# EAGLE design 1U_attenuvert_redesign (EAGLE 9.5.1)
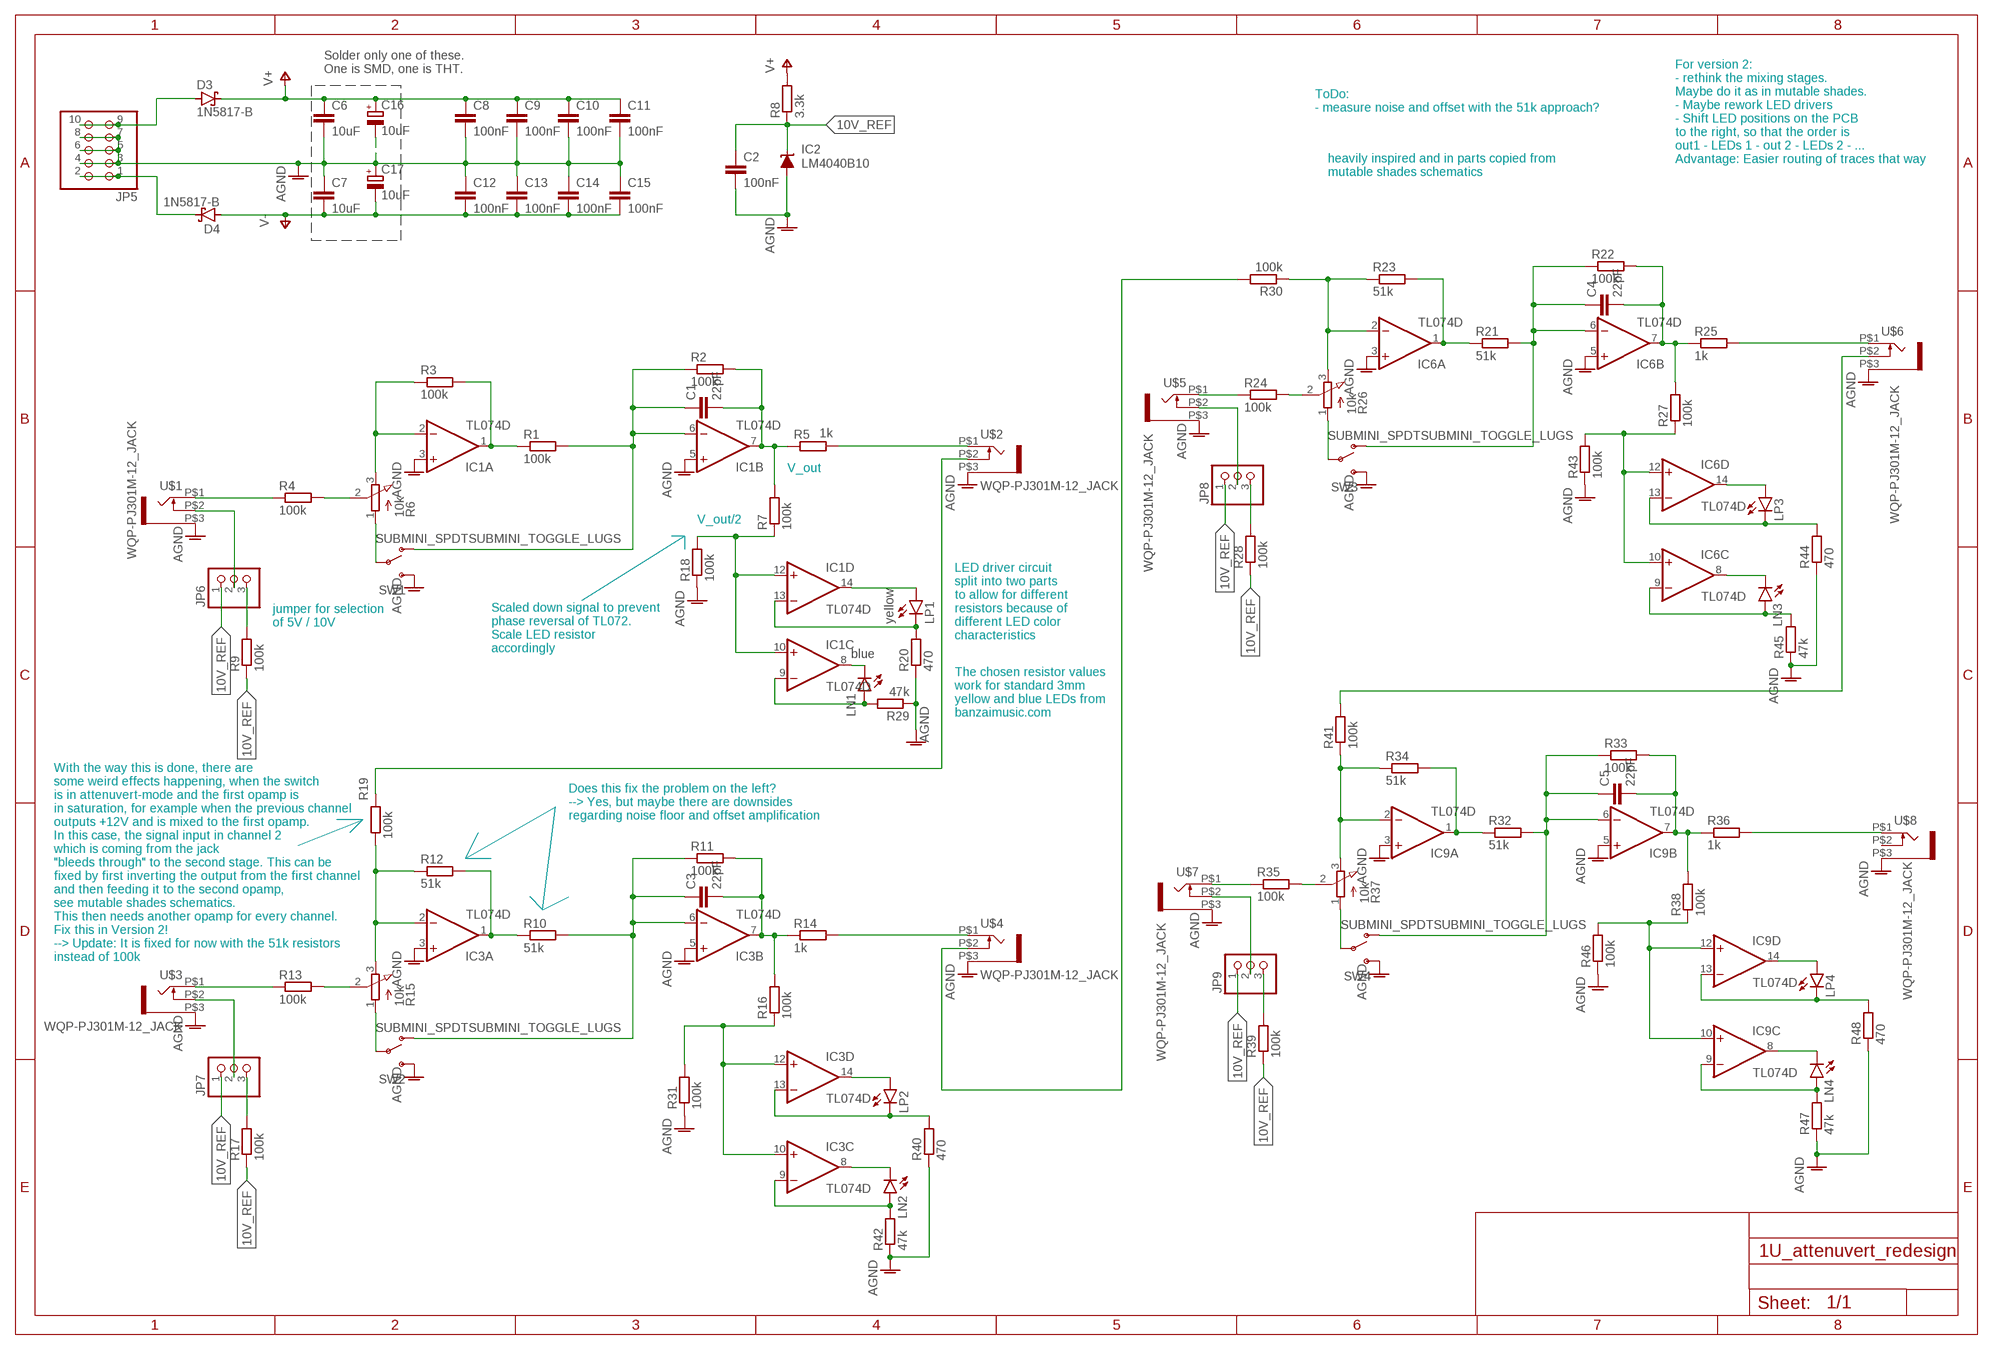
[diagram p0: schematic, sheet 1]

## Parts
C1  22pF  C-EUC0603  [C0603]
C2  100nF  C-EUC0603  [C0603]
C3  22pF  C-EUC0603  [C0603]
C4  22pF  C-EUC0603  [C0603]
C5  22pF  C-EUC0603  [C0603]
C6  10uF  C-EUC0805  [C0805]
C7  10uF  C-EUC0805  [C0805]
C8  100nF  C-EUC0603  [C0603]
C9  100nF  C-EUC0603  [C0603]
C10  100nF  C-EUC0603  [C0603]
C11  100nF  C-EUC0603  [C0603]
C12  100nF  C-EUC0603  [C0603]
C13  100nF  C-EUC0603  [C0603]
C14  100nF  C-EUC0603  [C0603]
C15  100nF  C-EUC0603  [C0603]
C16  10uF  CPOL-EUE2.5-6  [E2,5-6]
C17  10uF  CPOL-EUE2.5-6  [E2,5-6]
D3  1N5817-B  [DO41-7.6]
D4  1N5817-B  [DO41-7.6]
IC1  TL074D  [SO14]
IC2  LM4040B10  LM4041A12DBZ  [DBZ_R-PDSO-G3]
IC3  TL074D  [SO14]
IC6  TL074D  [SO14]
IC9  TL074D  [SO14]
JP5  PINHD-2X5  [2X05]
JP6  PINHD-1X3  [1X03]
JP7  PINHD-1X3  [1X03]
JP8  PINHD-1X3  [1X03]
JP9  PINHD-1X3  [1X03]
LN1  blue  LED3MM  [LED3MM]
LN2  LED3MM  [LED3MM]
LN3  LED3MM  [LED3MM]
LN4  LED3MM  [LED3MM]
LP1  yellow  LED3MM  [LED3MM]
LP2  LED3MM  [LED3MM]
LP3  LED3MM  [LED3MM]
LP4  LED3MM  [LED3MM]
R1  100k  R-EU_R0603  [R0603]
R2  100k  R-EU_R0603  [R0603]
R3  100k  R-EU_R0603  [R0603]
R4  100k  R-EU_R0603  [R0603]
R5  1k  R-EU_R0603  [R0603]
R6  10k  EVUF2L  [EVUFXL]
R7  100k  R-EU_R0603  [R0603]
R8  3.3k  R-EU_R0603  [R0603]
R9  100k  R-EU_R0603  [R0603]
R10  51k  R-EU_R0603  [R0603]
R11  100k  R-EU_R0603  [R0603]
R12  51k  R-EU_R0603  [R0603]
R13  100k  R-EU_R0603  [R0603]
R14  1k  R-EU_R0603  [R0603]
R15  10k  EVUF2L  [EVUFXL]
R16  100k  R-EU_R0603  [R0603]
R17  100k  R-EU_R0603  [R0603]
R18  100k  R-EU_R0603  [R0603]
R19  100k  R-EU_R0603  [R0603]
R20  470  R-EU_R0603  [R0603]
R21  51k  R-EU_R0603  [R0603]
R22  100k  R-EU_R0603  [R0603]
R23  51k  R-EU_R0603  [R0603]
R24  100k  R-EU_R0603  [R0603]
R25  1k  R-EU_R0603  [R0603]
R26  10k  EVUF2L  [EVUFXL]
R27  100k  R-EU_R0603  [R0603]
R28  100k  R-EU_R0603  [R0603]
R29  47k  R-EU_R0603  [R0603]
R30  100k  R-EU_R0603  [R0603]
R31  100k  R-EU_R0603  [R0603]
R32  51k  R-EU_R0603  [R0603]
R33  100k  R-EU_R0603  [R0603]
R34  51k  R-EU_R0603  [R0603]
R35  100k  R-EU_R0603  [R0603]
R36  1k  R-EU_R0603  [R0603]
R37  10k  EVUF2L  [EVUFXL]
R38  100k  R-EU_R0603  [R0603]
R39  100k  R-EU_R0603  [R0603]
R40  470  R-EU_R0603  [R0603]
R41  100k  R-EU_R0603  [R0603]
R42  47k  R-EU_R0603  [R0603]
R43  100k  R-EU_R0603  [R0603]
R44  470  R-EU_R0603  [R0603]
R45  47k  R-EU_R0603  [R0603]
R46  100k  R-EU_R0603  [R0603]
R47  47k  R-EU_R0603  [R0603]
R48  470  R-EU_R0603  [R0603]
SW1  SUBMINI_SPDTSUBMINI_TOGGLE_LUGS  [SUBMINI_TOGGLE_LUGS]
SW2  SUBMINI_SPDTSUBMINI_TOGGLE_LUGS  [SUBMINI_TOGGLE_LUGS]
SW3  SUBMINI_SPDTSUBMINI_TOGGLE_LUGS  [SUBMINI_TOGGLE_LUGS]
SW4  SUBMINI_SPDTSUBMINI_TOGGLE_LUGS  [SUBMINI_TOGGLE_LUGS]
U$1  WQP-PJ301M-12_JACK  [WQP-PJ301M-12_JACK]
U$2  WQP-PJ301M-12_JACK  [WQP-PJ301M-12_JACK]
U$3  WQP-PJ301M-12_JACK  [WQP-PJ301M-12_JACK]
U$4  WQP-PJ301M-12_JACK  [WQP-PJ301M-12_JACK]
U$5  WQP-PJ301M-12_JACK  [WQP-PJ301M-12_JACK]
U$6  WQP-PJ301M-12_JACK  [WQP-PJ301M-12_JACK]
U$7  WQP-PJ301M-12_JACK  [WQP-PJ301M-12_JACK]
U$8  WQP-PJ301M-12_JACK  [WQP-PJ301M-12_JACK]

## Nets
10V_REF [signal]: C2.1 IC2.1(C) JP6.1 JP7.1 JP8.1 JP9.1 R8.1 R9.1 R17.1 R28.1 R39.1
AGND [GND]: C2.2 C6.2 C7.1 C8.2 C9.2 C10.2 C11.2 C12.1 C13.1 C14.1 C15.1 C16.- C17.+ IC1.3(A:+IN) IC1.5(B:+IN) IC2.2(A) IC3.3(A:+IN) IC3.5(B:+IN) IC6.3(A:+IN) IC6.5(B:+IN) IC9.3(A:+IN) IC9.5(B:+IN) JP5.3 JP5.4 JP5.5 JP5.6 JP5.7 JP5.8 R18.1 R20.1 R29.1 R31.1 R40.1 R42.1 R43.1 R44.1 R45.1 R46.1 R47.1 R48.1 SW1.3(S) SW2.3(S) SW3.3(S) SW4.3(S) U$1.P$3 U$2.P$3 U$3.P$3 U$4.P$3 U$5.P$3 U$6.P$3 U$7.P$3 U$8.P$3
N$1 [signal]: C1.1 IC1.6(B:-IN) R1.2 R2.1 SW1.1(O)
N$2 [signal]: R4.2 R6.2(S)
N$3 [signal]: IC1.1(A:OUT) R1.1 R3.2
N$4 [signal]: IC1.2(A:-IN) R3.1 R6.3(E)
N$5 [signal]: C1.2 IC1.7(B:OUT) R2.2 R5.1 R7.2
N$6 [signal]: R5.2 U$2.P$1
N$7 [signal]: R6.1(A) SW1.COM(COMMON)
N$8 [signal]: IC1.10(C:+IN) IC1.12(D:+IN) R7.1 R18.2
N$9 [signal]: R4.1 U$1.P$1
N$10 [signal]: IC1.13(D:-IN) LP1.K(C) R20.2
N$11 [signal]: JP6.2 U$1.P$2
N$12 [signal]: C3.1 IC3.6(B:-IN) R10.2 R11.1 SW2.1(O)
N$13 [signal]: JP6.3 R9.2
N$14 [signal]: IC3.1(A:OUT) R10.1 R12.2
N$15 [signal]: IC3.2(A:-IN) R12.1 R15.3(E) R19.1
N$16 [signal]: C3.2 IC3.7(B:OUT) R11.2 R14.1 R16.2
N$17 [signal]: R14.2 U$4.P$1
N$18 [signal]: R13.2 R15.2(S)
N$19 [signal]: R15.1(A) SW2.COM(COMMON)
N$20 [signal]: IC3.9(C:-IN) LN2.A R42.2
N$21 [signal]: IC1.8(C:OUT) LN1.K(C)
N$22 [signal]: R13.1 U$3.P$1
N$23 [signal]: JP7.2 U$3.P$2
N$24 [signal]: JP7.3 R17.2
N$25 [signal]: R19.2 U$2.P$2
N$26 [signal]: IC1.9(C:-IN) LN1.A R29.2
N$27 [signal]: IC3.10(C:+IN) IC3.12(D:+IN) R16.1 R31.2
N$28 [signal]: C4.1 IC6.6(B:-IN) R21.2 R22.1 SW3.1(O)
N$29 [signal]: IC6.1(A:OUT) R21.1 R23.2
N$30 [signal]: IC6.2(A:-IN) R23.1 R26.3(E) R30.1
N$31 [signal]: C4.2 IC6.7(B:OUT) R22.2 R25.1 R27.2
N$32 [signal]: R25.2 U$6.P$1
N$33 [signal]: R24.2 R26.2(S)
N$34 [signal]: R26.1(A) SW3.COM(COMMON)
N$35 [signal]: IC6.10(C:+IN) IC6.12(D:+IN) R27.1 R43.2
N$36 [signal]: IC6.8(C:OUT) LN3.K(C)
N$37 [signal]: R24.1 U$5.P$1
N$38 [signal]: JP8.2 U$5.P$2
N$39 [signal]: JP8.3 R28.2
N$40 [signal]: R30.2 U$4.P$2
N$41 [signal]: IC3.13(D:-IN) LP2.K(C) R40.2
N$42 [signal]: IC6.9(C:-IN) LN3.A R45.2
N$43 [signal]: C5.1 IC9.6(B:-IN) R32.2 R33.1 SW4.1(O)
N$44 [signal]: IC9.1(A:OUT) R32.1 R34.2
N$45 [signal]: IC9.2(A:-IN) R34.1 R37.3(E) R41.1
N$46 [signal]: C5.2 IC9.7(B:OUT) R33.2 R36.1 R38.2
N$47 [signal]: R36.2 U$8.P$1
N$48 [signal]: R35.2 R37.2(S)
N$49 [signal]: R37.1(A) SW4.COM(COMMON)
N$50 [signal]: IC9.9(C:-IN) LN4.A R47.2
N$51 [signal]: IC9.10(C:+IN) IC9.12(D:+IN) R38.1 R46.2
N$52 [signal]: R35.1 U$7.P$1
N$53 [signal]: JP9.2 U$7.P$2
N$54 [signal]: JP9.3 R39.2
N$55 [signal]: R41.2 U$6.P$2
N$56 [signal]: IC1.14(D:OUT) LP1.A
N$57 [signal]: IC3.8(C:OUT) LN2.K(C)
N$58 [signal]: IC6.13(D:-IN) LP3.K(C) R44.2
N$59 [signal]: IC3.14(D:OUT) LP2.A
N$60 [signal]: IC6.14(D:OUT) LP3.A
N$61 [power]: D4.C JP5.1 JP5.2
N$62 [power]: D3.A JP5.9 JP5.10
N$64 [signal]: IC9.13(D:-IN) LP4.K(C) R48.2
N$65 [signal]: IC9.14(D:OUT) LP4.A
N$67 [signal]: IC9.8(C:OUT) LN4.K(C)
V+ [power]: C6.1 C8.1 C9.1 C10.1 C11.1 C16.+ D3.C R8.2
V- [power]: C7.2 C12.2 C13.2 C14.2 C15.2 C17.- D4.A
Unconnected: U$8.P$2

## Notes on the sheet
- Solder only one of these.
  One is SMD, one is THT.
- ToDo:
  - measure noise and offset with the 51k approach?
- For version 2:
  - rethink the mixing stages. 
  Maybe do it as in mutable shades.
  - Maybe rework LED drivers
  - Shift LED positions on the PCB 
  to the right, so that the order is
  out1 - LEDs 1 - out 2 - LEDs 2 - ...
  Advantage: Easier routing of traces that way
- heavily inspired and in parts copied from
  mutable shades schematics
- V_out
- V_out/2
- jumper for selection
  of 5V / 10V
- LED driver circuit
  split into two parts
  to allow for different
  resistors because of
  different LED color
  characteristics
- Scaled down signal to prevent
  phase reversal of TL072.
  Scale LED resistor
  accordingly
- The chosen resistor values
  work for standard 3mm
  yellow and blue LEDs from
  banzaimusic.com
- Does this fix the problem on the left?
  --> Yes, but maybe there are downsides
  regarding noise floor and offset amplification
- With the way this is done, there are
  some weird effects happening, when the switch
  is in attenuvert-mode and the first opamp is
  in saturation, for example when the previous channel
  outputs +12V and is mixed to the first opamp.
  In this case, the signal input in channel 2
  which is coming from the jack 
  "bleeds through" to the second stage. This can be 
  fixed by first inverting the output from the first channel 
  and then feeding it to the second opamp, 
  see mutable shades schematics.
  This then needs another opamp for every channel.
  Fix this in Version 2!
  --> Update: It is fixed for now with the 51k resistors 
  instead of 100k

## Power pins joined to a net without a drawn wire
V+: IC1.4(P:V+) IC3.4(P:V+) IC6.4(P:V+) IC9.4(P:V+)
V-: IC1.11(P:V-) IC3.11(P:V-) IC6.11(P:V-) IC9.11(P:V-)

## Library data of the parts
C1-C15 = rcl:C-EU: CAPACITOR, European symbol; SPICEPREFIX: C
C16 C17 = rcl:CPOL-EU: POLARIZED CAPACITOR, European symbol; SPICEPREFIX: C
D3 D4 = diode:1N581*: 1.0A SCHOTTKY BARRIER RECTIFIER Source: http://www.diodes.com/datasheets/ds23001.pdf
IC1 IC3 IC6 IC9 = linear:TL074: OP AMP
IC2 = texas:LM4041: PRECISION MICROPOWER SHUNT VOLTAGE REFERENCE Source: http://focus.ti.com/lit/ds/slcs146e/slcs146e.pdf; MPN: LM4041A12IDBZR; OC_FARNELL: 1407949; OC_NEWARK: 58K5875
JP5 = pinhead:PINHD-2X5: PIN HEADER
JP6-JP9 = pinhead:PINHD-1X3: PIN HEADER
LN1-LN4 LP1-LP4 = led:LED: LED OSRAM: - CHIPLED LG R971, LG N971, LY N971, LG Q971, LY Q971, LO R971, LY R971 LH N974, LH R974 LS Q976, LO Q976, LY Q976 LO Q996 - Hyper CHIPLED LW Q18S LB Q993, LB Q99A, LB R99A - SideLED LS A670, LO A670, LY A670, LG A670, LP A670 LB A673, LV A673, LT A673, LW A673 LH A674 LY A675 LS A676, LA A676, LO A676, LY A676, LW A676 LS A679, LY A679, LG A679 - Hyper Micro SIDELED® LS Y876, LA Y876, LO Y876, LY Y876 LT Y87S - SmartLED LW L88C, LW L88S LB L89C, LB L89S, LG L890 LS L89K, LO L89K, LY L89K LS L896, LA L896, LO L896, LY L896 - TOPLED LS T670, LO T670, LY T670, LG T670, LP T670 LSG T670, LSP T670, LSY T670, LOP T670, LYG T670 LG T671, LOG T671, LSG T671 LB T673, LV T673, LT T673, LW T673 LH T674 LS T676, LA T676, LO T676, LY T676, LB T676, LH T676, LSB T676, LW T676 LB T67C, LV T67C, LT T67C, LS T67K, LO T67K, LY T67K, LW E67C LS E67B, LA E67B, LO E67B, LY E67B, LB E67C, LV E67C, LT E67C LW T67C LS T679, LY T679, LG T679 LS T770, LO T770, LY T770, LG T770, LP T770 LB T773, LV T773, LT T773, LW T773 LH T774 LS E675, LA E675, LY E675, LS T675 LS T776, LA T776, LO T776, LY T776, LB T776 LHGB T686 LT T68C, LB T68C - Hyper Mini TOPLED® LB M676 - Mini TOPLED Santana® LG M470 LS M47K, LO M47K, LY M47K Source: http://www.osram.convergy.de LUXEON: - LUMILED® LXK2-PW12-R00, LXK2-PW12-S00, LXK2-PW14-U00, LXK2-PW14-V00 LXK2-PM12-R00, LXK2-PM12-S00, LXK2-PM14-U00 LXK2-PE12-Q00, LXK2-PE12-R00, LXK2-PE12-S00, LXK2-PE14-T00, LXK2-PE14-U00 LXK2-PB12-K00, LXK2-PB12-L00, LXK2-PB12-M00, LXK2-PB14-N00, LXK2-PB14-P00, LXK2-PB14-Q00 LXK2-PR12-L00, LXK2-PR12-M00, LXK2-PR14-Q00, LXK2-PR14-R00 LXK2-PD12-Q00, LXK2-PD12-R00, LXK2-PD12-S00 LXK2-PH12-R00, LXK2-PH12-S00 LXK2-PL12-P00, LXK2-PL12-Q00, LXK2-PL12-R00 Source: www.luxeon.com KINGBRIGHT: KA-3528ASYC Source: www.kingbright.com
R1-R5 R7-R14 R16-R25 R27-R36 R38-R48 = rcl:R-EU_: RESISTOR, European symbol; SPICEPREFIX: R
R6 R15 R26 R37 = pot_EVU_no_holes:EVU: 9 mm Square Rotary Potentiometers Source: Panasonic
SW1-SW4 = MusicThingModular:SUBMINI_SPDT
U$1-U$8 = thonkiconn:WQP-PJ301M-12_JACK

## Net classes
1 signal: width 0.254 mm, clearance 0.254 mm
2 power: width 0.254 mm, clearance 0.508 mm to class 1, clearance 0.508 mm
3 GND: width 0.254 mm, clearance 0.508 mm to class 1, clearance 0.508 mm to class 2, clearance 0.508 mm

## Board
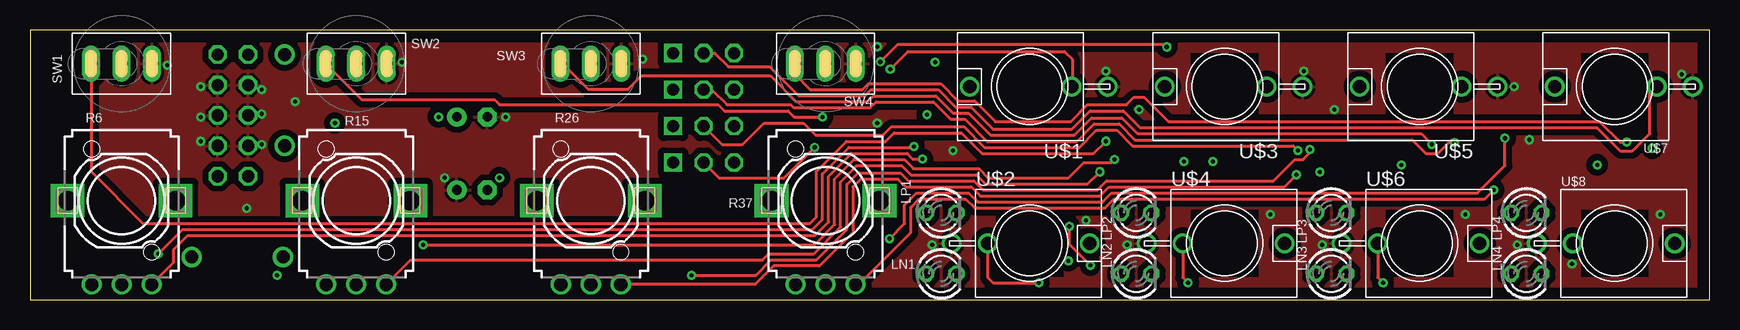
[diagram p1: board, top side]
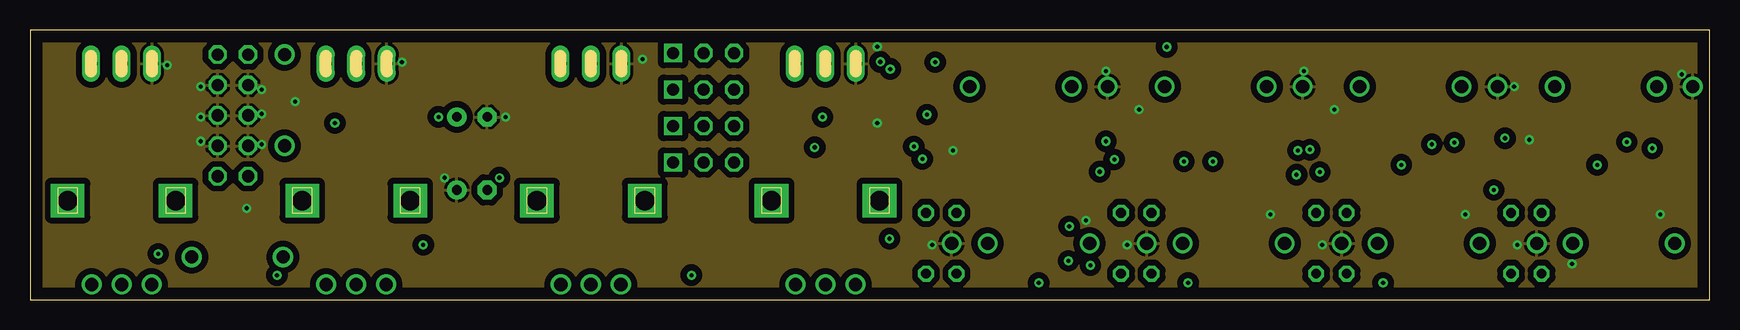
[diagram p2: board, inner layer Route2]
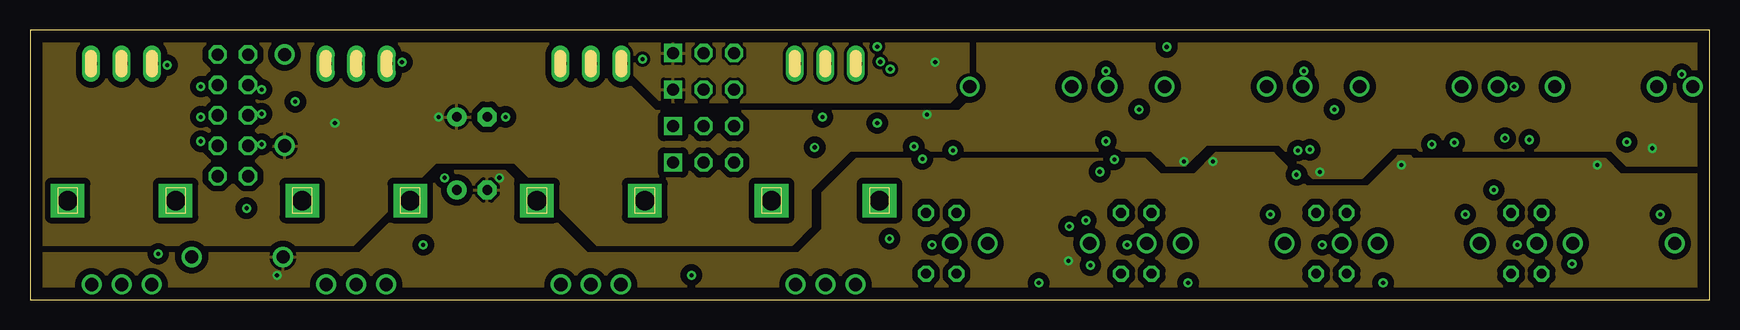
[diagram p3: board, inner layer Route15]
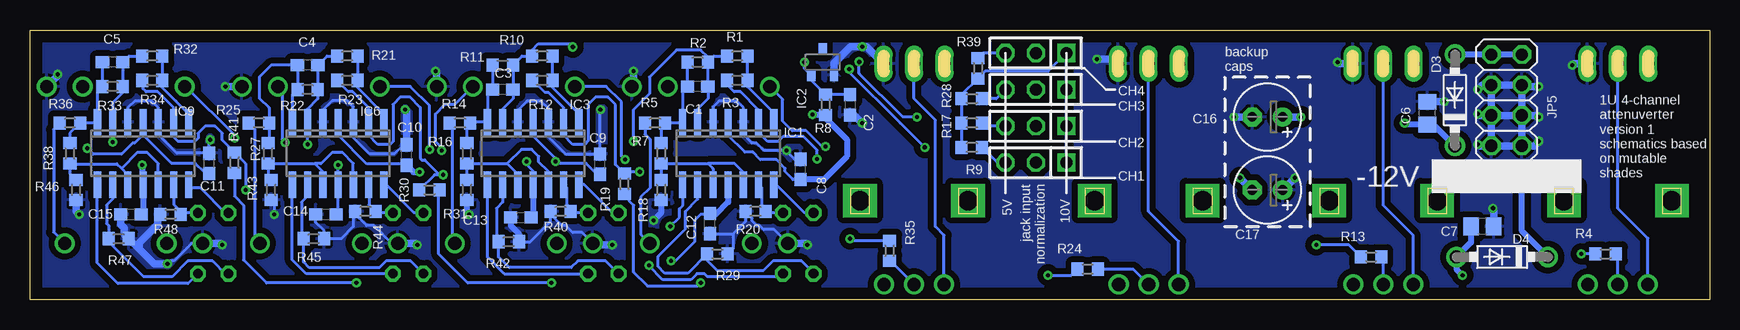
[diagram p4: board, bottom side, seen from below]

Size 140 x 22.5 mm. Coordinates in mm from the lower left corner, seen from the top.
Outline: 0,0 140,0 140,22.5 0,22.5 0,0
Copper layers (1+2*15+16): Top 0.035mm / dielectric 1.5mm / Route2 0.035mm / dielectric 0.15mm / Route15 0.035mm / dielectric 0.2mm / Bottom 0.035mm
Design rules "default *": minimum track width 6mil, minimum drill 0.35mm, track to track 6mil, track to pad 6mil, pad to pad 6mil, via to via 6mil, smd to smd 6mil, copper to edge 40mil, drill to drill 6mil, minimum pad ring 10mil, minimum via ring 8mil, stop-mask expansion 4mil, vias tented up to drill 0mil, thermal gap 10mil

### Footprints (pad centres in the part's own frame; a part is rotated, then mirrored left to right if it is on the bottom)
C0603 = smd 1.1 x 1: 1 -0.85,0; 2 0.85,0
C0805 = smd 1.3 x 1.5: 1 -0.95,0; 2 0.95,0
E2,5-6 = drill 0.813 pad 1.6: + -1.27,0 | drill 0.813 pad 1.6 octagon: - 1.27,0
DO41-7.6 = drill 1.1 pad 1.7: A 3.81,0; C -3.81,0
SO14 = smd 0.6 x 2.2: 1 -3.81,-2.6; 2 -2.54,-2.6; 3 -1.27,-2.6; 4 0,-2.6; 5 1.27,-2.6; 6 2.54,-2.6; 7 3.81,-2.6; 8 3.81,2.6; 9 2.54,2.6; 10 1.27,2.6; 11 0,2.6; 12 -1.27,2.6; 13 -2.54,2.6; 14 -3.81,2.6
DBZ_R-PDSO-G3 = smd 0.7 x 1: 1 -0.95,-1.1; 2 0.95,-1.1; 3 0,1.1
2X05 = drill 1.016 octagon: 1 -5.08,-1.27; 2 -5.08,1.27; 3 -2.54,-1.27; 4 -2.54,1.27; 5 0,-1.27; 6 0,1.27; 7 2.54,-1.27; 8 2.54,1.27; 9 5.08,-1.27; 10 5.08,1.27
1X03 = drill 1.016 square: 1 -2.54,0 | drill 1.016 octagon: 2 0,0; 3 2.54,0
LED3MM = drill 0.813 octagon: A -1.27,0; K 1.27,0
R0603 = smd 1 x 1.1: 1 -0.85,0; 2 0.85,0
EVUFXL = drill 1.1 pad 1.676: 1 -2.5,-7; 2 0,-7; 3 2.5,-7 | drill 1.6 pad 2.8 square: M1 4.5,0; M2 -4.5,0
SUBMINI_TOGGLE_LUGS = drill 1 pad 1.422 long: 1 -2.54,0; 3 2.54,0; COM 0,0
WQP-PJ301M-12_JACK = drill 1.1: P$1 0,5; P$2 0,-3.5; P$3 0,-6.5

### Placement (x,y rotation side)
C1  84.34,17.78 180 bottom
C2  71.64,16.26 270 bottom
C3  100.6,17.53 180 bottom
C4  116.86,19.56 180 bottom
C5  133.11,19.81 180 bottom
C6  23.51,15.55 90 bottom
C7  18.94,6.1 180 bottom
C8  75.77,10.86 90 bottom
C9  92.47,11.3 90 bottom
C10  108.6,12.06 90 bottom
C11  125.05,11.37 90 bottom
C12  83.33,6.35 90 bottom
C13  99.08,6.86 0 bottom
C14  115.33,7.11 0 bottom
C15  131.59,7.11 0 bottom
C16  36.85,15.24 180 bottom
C17  36.85,9.14 180 bottom
D3  21.23,16.64 90 bottom
D4  17.29,3.56 180 bottom
IC1  81.8,12.19 180 bottom
IC2  73.93,19.81 0 bottom
IC3  98.06,12.19 180 bottom
IC6  114.32,12.19 180 bottom
IC9  130.57,12.19 180 bottom
JP5  16.91,15.37 90 bottom
JP6  56.15,11.43 180 bottom
JP7  56.15,14.48 180 bottom
JP8  56.15,17.53 180 bottom
JP9  56.15,20.57 180 bottom
LN1  75.96,2.16 0 top
LN2  92.22,2.16 0 top
LN3  108.47,2.16 0 top
LN4  124.73,2.16 0 top
LP1  75.96,7.24 0 top
LP2  92.22,7.24 0 top
LP3  108.47,7.24 0 top
LP4  124.73,7.24 0 top
R1  81.04,20.32 180 bottom
R2  84.34,19.81 180 bottom
R3  81.04,18.29 0 bottom
R4  8.65,3.81 0 bottom
R5  87.9,14.73 180 bottom
R6  7.64,8.26 0 top
R7  87.39,12.19 90 bottom
R8  73.68,16.26 270 bottom
R9  61.48,12.7 0 bottom
R10  97.3,20.32 180 bottom
R11  100.6,19.56 180 bottom
R12  97.3,18.29 0 bottom
R13  28.21,3.56 0 bottom
R14  104.16,14.73 180 bottom
R15  27.19,8.26 0 top
R16  103.58,12.19 90 bottom
R17  61.48,14.73 0 bottom
R18  87.39,9.14 90 bottom
R19  90.44,9.65 270 bottom
R20  79.52,7.37 0 bottom
R21  113.55,20.32 180 bottom
R22  116.86,17.53 180 bottom
R23  113.55,18.29 0 bottom
R24  51.83,2.54 0 bottom
R25  120.92,14.73 180 bottom
R26  46.75,8.26 0 top
R27  120.16,12.19 90 bottom
R28  61.48,16.76 0 bottom
R29  82.69,3.81 180 bottom
R30  106.7,9.14 0 bottom
R31  103.58,9.14 90 bottom
R32  129.81,20.32 180 bottom
R33  133.11,17.78 180 bottom
R34  129.81,18.29 0 bottom
R35  68.34,4.06 270 bottom
R36  136.67,14.73 180 bottom
R37  66.31,8.26 0 top
R38  136.67,12.19 90 bottom
R39  60.98,19.3 90 bottom
R40  95.77,7.37 0 bottom
R41  122.95,11.43 270 bottom
R42  100.09,4.83 180 bottom
R43  119.9,9.14 90 bottom
R44  112.03,7.37 0 bottom
R45  116.35,5.08 180 bottom
R46  136.16,9.14 90 bottom
R47  132.6,5.08 180 bottom
R48  128.29,7.11 0 bottom
SW1  7.64,19.68 0 top
SW2  27.19,19.68 0 top
SW3  46.75,19.68 0 top
SW4  66.31,19.68 0 top
U$1  83.33,17.78 90 top
U$2  83.33,4.7 270 top
U$3  99.58,17.78 90 top
U$4  99.58,4.7 270 top
U$5  115.84,17.78 90 top
U$6  115.84,4.7 270 top
U$7  132.1,17.78 90 top
U$8  132.1,4.7 270 top

### Tracks (layer width: path | path; a pad name or v marks a point on that pad's centre or on a via)
10V_REF  (via drill 0.35)
  Bottom 0.254: JP6.1 JP7.1 JP8.1 JP9.1 55.13,19.05 60.38,19.05 R39.1 62.33,17.1 R28.1 R17.1 R9.1 | v75.45,19.81 75.45,19.29 IC2.1 74.88,18.31 R8.1 C2.1
  pour Route15: 47.01,22.1 52.59,16.51 76.72,16.51 78.25,18.03 78.25,22.1
AGND  (via drill 0.35)
  Bottom 0.254: C11.2 125.05,12.13 | 129.16,14.65 129.16,13.62 127.75,12.22 C11.2 | C10.2 108.87,12.91 109.63,12.15 111.68,12.15 113.05,13.52 IC6.3 113.05,16.08 113.55,16.59 114.81,16.59 114.87,16.53 114.88,16.53 115.59,15.82 IC6.5 | C14.1 116.18,6.44 115.5,5.75 R45.1 114.06,5.08 113.05,6.1 113.05,7.2 R44.1 112.57,7.05 112.57,6.81 111.94,6.18 111.33,6.18 109.85,4.7 U$6.P$3 | R43.1 119.65,8.04 v119.65,7.11 | U$4.P$3 93.97,5.59 94.76,5.59 95.35,6.18 95.69,6.18 96.62,7.12 R40.1 96.62,6.51 98.31,4.83 R42.1 | v128.54,2.99 128.29,3.24 127.99,3.24 126.53,4.7 U$8.P$3 | U$2.P$3 77.97,5.84 78.84,5.84 79.18,6.18 79.43,6.18 79.8,6.55 79.8,6.8 R20.1 80.37,6.52 81.38,5.5 | C11.2 125.05,13.27 v124.98,13.34 | C9.2 92.56,12.06 | C9.2 92.89,12.15 | C9.2 92.5,12.13 95.35,12.13 96.79,13.57 IC3.3 96.79,15.94 97.42,16.57 98.58,16.57 99.33,15.82 IC3.5 | C9.2 92.47,15.85 v92.45,15.87 | C8.2 76.28,11.71 76.94,12.37 v76.94,12.44 v76.94,12.45 78.82,12.45 79.43,13.06 79.83,13.06 80.45,13.68 80.45,14.71 IC1.3 80.53,16.01 81.09,16.57 82.58,16.57 83.07,16.07 IC1.5 | C12.1 81.38,5.5 | 81.38,5.5 81.38,4.27 R29.1 | 131.76,14.87 IC9.5 131.84,16 131.27,16.57 129.87,16.57 129.3,16 IC9.3
  Bottom 0.305: 129.16,14.65 IC9.3
  Bottom 0.508: R18.1 87.39,7.25 v88.03,6.61 | R31.1 103.58,7.3 v103.39,7.11 | C13.1 99.93,6.18 99.24,5.5 R42.1
  Bottom 0.635: JP5.7 JP5.5 | JP5.7 JP5.8 | JP5.8 JP5.6 | JP5.6 JP5.5 | JP5.5 JP5.3 | JP5.3 JP5.4 | JP5.6 JP5.4 | JP5.6 18.43,15.37 | C6.2 v22.12,16.5 v22.11,16.51 | JP5.7 15.51,17.78 v14.24,17.78 | JP5.5 14.37,15.37 v14.24,15.24 | JP5.3 14.62,12.83 v14.24,13.21 | JP5.8 18.94,17.91 v19.32,17.53 | JP5.6 19.19,15.37 v19.32,15.49 | JP5.4 19.19,12.83 v19.32,12.95 | SW1.3 11.32,19.68 v11.45,19.56 | C7.1 17.99,7.56 v18.05,7.62 | SW2.3 30.88,19.68 v31,19.81 | C17.+ v34.56,10.16 | C16.- v39.64,15.24 | SW3.3 49.67,20.07 v51.07,20.07 | SW4.3 70.27,21.11 v70.63,21.11 71.6,21.11 72.98,19.73 IC2.2 | C2.2 71.3,15.41 v70.63,14.73 | U$2.P$3 75.33,4.7 v75.2,4.57 | v89.68,19.05 89.68,17.93 U$1.P$3 | U$5.P$3 v123.71,17.78 | U$7.P$3 137.68,18.69 v137.68,18.8 | U$8.P$3 124.09,4.7 v123.97,4.57 | U$6.P$3 107.84,4.7 v107.71,4.57 | U$4.P$3 92.96,4.57 v91.46,4.57 | R46.1 136.16,7.37 v135.91,7.11 | 130.91,4.24 R47.1 132.13,5.46 132.13,5.97 132.44,6.28 C15.1 | 130.91,4.24 129.66,2.99 v128.54,2.99 | R48.1 129.36,6.89 129.36,6.27 130.91,4.72 130.91,4.24 | U$3.P$3 106.08,18.95 v106.19,19.05 | C10.2 108.6,15.74 v108.73,15.87
  pour Route2: -1.64,22.86 -1.64,-0.13 141.88,-0.13 141.88,22.86
  pour Bottom: -0.75,22.86 -0.75,-0.25 141.24,-0.25 141.24,22.86
  pour Top: -1.25,22.61 -1.25,-0.25 141.24,-0.25 141.24,22.61
N$1  (via drill 0.35)
  Top 0.254: SW1.1 5.1,10.67 9.41,6.35 65,6.35 65.55,6.89 65.55,10.7 68.05,13.21 71.33,13.21 72.03,13.91 77.64,13.91 79.35,12.19 88.66,12.19 v89.68,13.21
  Bottom 0.254: 81.89,20.14 R1.2 82.99,20.32 R2.1 | 84.39,13.81 84.39,14.75 IC1.6 84.34,15.91 83.49,16.76 C1.1 R2.1 | v89.68,13.21 89.68,15.87 88.37,17.18 88.37,18.58 86.12,20.83 84.09,20.83 83.49,20.23 R2.1
N$2
  Bottom 0.254: R6.2 7.64,3.64 R4.2
N$3
  Bottom 0.254: 80,20.51 R1.1 R3.2 80.19,17.76 77.99,15.56 IC1.1 77.99,15.39
N$4  (via drill 0.35)
  Top 0.254: R6.3 11.99,3.11 11.99,4.17 13.16,5.33 65.42,5.33 66.56,6.47 66.56,10.28 68.47,12.19 73.11,12.19 73.62,11.69 74.39,11.69 v74.39,11.73
  Bottom 0.254: v74.39,11.73 74.39,12.46 75.51,13.59 77.25,13.59 77.63,13.21 78.5,13.21 79.26,13.97 IC1.2 79.26,15.82 80.78,17.34 81.3,17.34 81.89,17.93 R3.1
N$5
  Bottom 0.254: R7.2 87.39,14.39 R5.1 85.67,14.73 IC1.7 85.61,17.36 C1.2 R2.2
N$6
  Bottom 0.254: 88.62,14.61 R5.2 88.75,13.8 88.32,13.38 88.32,9.31 89.08,8.55 89.08,5.46 U$2.P$1
N$7
  Bottom 0.254: R6.1 5.14,5.12 7.64,7.62 SW1.COM
N$8
  Bottom 0.254: R18.2 R7.1 83.49,11.34 | 83.49,11.34 83.07,10.92 IC1.10 | 83.49,11.34 81.26,11.34 80.53,10.62 IC1.12
N$9  (via drill 0.35)
  Top 0.254: v10.68,3.81 12.72,5.84 65.21,5.84 66.06,6.68 66.06,10.49 68.26,12.7 73.61,12.7 v73.68,12.77
  Bottom 0.254: R4.1 v10.68,3.81 | v73.68,12.77 73.87,12.77 | 77.23,16.68 77.27,16.72 | 77.27,16.72 U$1.P$1 | v73.68,12.77 73.85,12.77 | v73.68,12.77 73.97,12.77 75.3,14.1 76.47,14.1 77.27,14.9 77.27,16.72
N$10
  Bottom 0.254: LP1.K 78.54,7.24 | 78.54,7.24 79.05,7.24 79.01,7.28 79.01,9.34 IC1.13 | 78.54,7.24 R20.2
N$11  (via drill 0.35)
  Top 0.254: JP6.2 57.42,10.16 62.87,10.16 v65.41,12.7 | v71.71,19.24 73.18,20.71 86.24,20.71 86.88,20.07 86.88,17.84 U$1.P$2
  Bottom 0.254: v65.41,12.7 67.44,14.73 67.46,14.73 71.71,18.98 v71.71,19.24
N$12  (via drill 0.35)
  Top 0.254: SW2.1 27.66,16.68 38.71,16.68 39.13,16.26 57.37,16.26 57.88,15.75 63.19,15.75 63.71,15.23 v66.06,15.23 | v94.76,21.08 94.54,21.3 81.04,21.3 72.34,21.3 v70.88,19.84
  Bottom 0.254: IC3.6 100.6,15.91 99.75,16.76 C3.1 R11.1 98.99,20.32 R10.2 98.15,20.83 97.64,21.34 95.01,21.34 v94.76,21.08 | v66.06,15.23 67.25,15.23 70.88,18.87 v70.88,19.84
N$13
  Bottom 0.254: JP6.3 59.36,11.43 R9.2
N$14
  Bottom 0.254: 94.25,15.55 IC3.1 94.25,15.49 96.45,17.69 R12.2 R10.1
N$15  (via drill 0.35)
  Top 0.254: R15.3 31.74,3.3 61.06,3.3 61.57,3.81 65.34,3.81 67.58,6.05 67.58,9.82 68.89,11.13 68.89,11.18 72.67,11.18 73.43,10.41 78.88,10.41 79.64,9.66 88.16,9.66 v89.17,10.66
  Bottom 0.254: R19.1 90.52,10.58 | 97.87,18.29 R12.1 98.06,18.29 97.04,17.27 96.79,17.27 95.52,16 IC3.2 95.52,13.72 94.76,12.95 93.75,12.95 93.47,13.23 93.47,16.29 92.87,16.88 91.82,16.88 91.2,16.26 91.2,11.26 R19.1 | v89.17,10.66 90.28,10.66 R19.1
N$16
  Bottom 0.254: R11.2 C3.2 101.87,17.11 IC3.7 103.25,14.79 R14.1 103.58,14.45 R16.2
N$17
  Bottom 0.254: R14.2 104.82,14.54 104.82,4.93 U$4.P$1
N$18
  Bottom 0.254: R15.2 27.19,3.39 R13.2
N$19
  Bottom 0.254: R15.1 24.69,5.37 27.19,7.87 SW2.COM
N$20
  Bottom 0.254: LN2.A 92.03,3.24 94.31,3.24 94.89,2.67 100.05,2.67 100.94,3.56 R42.2 101.11,5 101.11,7.62 100.6,8.13 IC3.9
N$21  (via drill 0.35)
  Top 0.254: v88.4,2.85 86.63,4.62 v86.63,6.1
  Bottom 0.254: LN1.K 77.49,1.91 83.53,1.91 83.78,2.15 84.4,2.15 84.91,1.65 87.27,1.65 88.41,2.79 v88.41,2.84 v88.4,2.85 | IC1.8 85.57,9.55 85.57,7.87 85.87,7.58 85.87,6.86 v86.63,6.1
N$22  (via drill 0.35)
  Top 0.254: v90.39,11.69 90.13,11.43 87.85,11.43 86.58,10.17 79.85,10.17 79.09,10.92 73.64,10.92 72.88,11.68 68.68,11.68 67.07,10.07 67.07,6.26 65.38,4.57 v32.78,4.57
  Bottom 0.254: R13.1 30.08,4.57 v32.78,4.57 | v90.39,11.69 90.44,11.69 90.69,11.94 90.69,16.51 91.96,17.78 U$3.P$1
N$23  (via drill 0.35)
  Top 0.254: JP7.2 57.67,12.95 59.42,12.95 61.19,14.73 64.47,14.73 65.48,13.72 71.12,13.72 71.82,14.42 77.84,14.42 79.56,12.7 87.47,12.7 88.91,14.14 90.59,14.14 91.91,12.82 105.31,12.82 v105.68,12.45
  Bottom 0.254: U$3.P$2 104.61,16.26 105.43,16.26 106.19,15.49 106.19,13.21 105.68,12.7 v105.68,12.45
N$24
  Bottom 0.254: JP7.3 60.38,14.48 R17.2
N$25  (via drill 0.35)
  Top 0.254: U$2.P$2 79.83,1.85 80.28,1.39 v84.09,1.39
  Bottom 0.254: R19.2 90.44,8.64 89.68,7.87 89.68,2.29 88.53,1.14 84.34,1.14 v84.09,1.39
N$26
  Bottom 0.254: LN1.A 74.69,2.22 75.7,3.23 78.07,3.23 78.88,2.41 82.67,2.41 83.54,3.29 R29.2 | R29.2 | R29.2 83.58,3.85 | IC1.9 84.34,8.38 85.36,7.37 85.36,5.88 87.64,3.6 87.64,2.75 87.09,2.2 85.15,2.2 R29.2 | R29.2 83.84,3.81
N$27
  Bottom 0.254: R31.2 R16.1 100.22,11.34 | IC3.12 96.79,10.67 97.59,11.47 97.59,11.94 98.19,12.53 99.03,12.53 100.22,11.34 | IC3.10 99.33,10.46 100.22,11.34
N$28  (via drill 0.35)
  Top 0.254: SW3.1 44.39,19.68 46.54,17.54 49.87,17.54 50.99,18.67 61.71,18.67 63.87,16.51 69.83,16.51 70.31,16.99 75.52,16.99 76.95,15.56 78.23,15.56 80.07,13.72 87.05,13.72 88.49,15.16 91.01,15.16 92.33,13.84 115.97,13.84 v116.86,12.95
  Bottom 0.254: R21.2 115.24,20.32 C4.1 R22.1 116.01,16.76 116.86,15.91 IC6.6 v116.86,12.95
N$29
  Bottom 0.254: IC6.1 110.51,15.49 112.7,17.69 R23.2 R21.1
N$30  (via drill 0.35)
  Top 0.254: R26.3 60.45,1.25 61.99,2.79 65.8,2.79 68.6,5.59 68.6,9.4 69.23,10.04 72.37,10.04 73.01,9.4 78.46,9.4 79.21,8.64 89.19,8.64 89.94,9.39 104.56,9.39 v105.58,10.41
  Bottom 0.254: R23.1 113.47,17.35 113.12,17.35 111.78,16.01 IC6.2 111.78,13.72 111.01,12.95 110,12.95 109.74,13.21 109.74,16.28 109.15,16.88 108.31,16.88 107.47,16.04 107.47,11.78 107.34,11.65 107.1,11.65 105.86,10.41 v105.58,10.41 106.28,10.41 R30.1
N$31
  Bottom 0.254: 118.19,14.73 IC6.7 118.13,17.11 R22.2 C4.2 119.9,19.56 120.88,18.58 120.88,16.81 120.07,16 R25.1 120.07,13.13 R27.2
N$32
  Bottom 0.254: R25.2 121.26,14.22 121.26,5.12 U$6.P$1
N$33
  Bottom 0.254: R26.2 48.04,2.54 R24.2
N$34
  Bottom 0.254: R26.1 44.25,4.87 46.75,7.37 SW3.COM
N$35
  Bottom 0.254: 116.26,11.34 R27.1 120.16,10.25 R43.2 | IC6.10 115.59,10.67 116.26,11.34 | IC6.12 113.05,11.37 113.94,12.26 114.82,12.26 115.74,11.34 116.26,11.34
N$36
  Bottom 0.254: IC6.8 118.13,3.3 116.98,2.15 110.13,2.15 110.12,2.16 LN3.K
N$37  (via drill 0.35)
  Top 0.254: v55.13,2.03 60.51,2.03 61.78,3.3 65.55,3.3 68.09,5.84 68.09,9.61 69.02,10.54 72.58,10.54 73.22,9.91 78.67,9.91 79.42,9.15 88.98,9.15 89.73,9.9 103.64,9.9 105.43,11.68 106.12,11.68 106.7,12.26 v106.7,12.51
  Bottom 0.254: v106.7,12.51 106.7,16.18 108.3,17.78 U$5.P$1 | v55.13,2.03 53.19,2.03 R24.1
N$38  (via drill 0.35)
  Top 0.254: JP8.2 56.82,17.53 58.09,16.26 63.4,16.26 63.66,16 70.04,16 70.52,16.48 75.31,16.48 76.74,15.05 77.93,15.05 79.77,13.21 87.26,13.21 88.7,14.65 90.8,14.65 92.12,13.33 115.21,13.33 116.35,12.19 117.36,12.19 118.28,13.11 v118.73,13.11
  Bottom 0.254: U$5.P$2 119,17.44 119,13.37 v118.73,13.11
N$39
  Bottom 0.254: JP8.3 59.45,16.76 R28.2
N$40  (via drill 0.35)
  Top 0.254: U$4.P$2 96.08,1.85 v96.54,1.39
  Bottom 0.254: v96.54,1.39 103.52,1.39 105.93,3.81 105.93,9.06 R30.2
N$41
  Bottom 0.254: IC3.13 95.27,9.34 95.27,7.96 94.92,7.62 R40.2 94.8,7.24 LP2.K
N$42
  Bottom 0.254: LN3.A 108.27,3.23 110.33,3.23 110.89,2.66 116.72,2.66 117.2,3.14 R45.2 117.2,5.42 117.37,5.59 117.37,8.13 116.86,8.64 IC6.9
N$43  (via drill 0.35)
  Top 0.254: v133.11,13.14 v133.1,13.13 132.54,13.13 130.83,14.85 94.9,14.85 92.87,16.88 92.03,16.88 91.41,16.26 88.15,16.26 86.75,14.85 80.47,14.85 78.75,16.57 77.37,16.57 75.94,18.01 69.89,18.01 69.41,17.53 65.04,17.53 63.77,18.8 SW4.1
  Bottom 0.254: R32.2 131.75,20.32 C5.1 R33.1 132.26,17.27 133.11,16.42 IC9.6 v133.11,13.14
N$44
  Bottom 0.254: IC9.1 126.76,15.49 127.84,16.57 127.85,16.57 128.96,17.68 R34.2 R32.1
N$45  (via drill 0.35)
  Top 0.254: v122.02,9.14 121.26,8.38 90.36,8.38 89.61,7.63 78.75,7.63 77.99,8.38 74.11,8.38 73.42,7.7 73.42,5.59 69.09,1.25 R37.3
  Bottom 0.254: 130.5,18.29 130.57,18.29 | 130.57,18.29 R34.1 | v122.02,9.14 122.02,11.35 R41.1 123.97,13.3 123.97,13.88 124.56,14.47 125.4,14.47 126,13.88 126,13.46 126.25,13.21 127.67,13.21 128.03,13.57 IC9.2 128.03,16 129.37,17.34 130.32,17.34 130.57,17.59 130.57,18.29 | v122.02,9.14
N$46
  Bottom 0.254: C5.2 R33.2 134.38,17.36 IC9.7 134.44,14.73 R36.1 136.67,13.88 R38.2
N$47
  Bottom 0.254: R36.2 138.03,14.22 138.03,5.63 U$8.P$1
N$48
  Bottom 0.254: R37.2 68.27,3.21 R35.2
N$49
  Bottom 0.254: R37.1 63.81,5.37 64.53,6.1 64.53,14.99 66.31,16.76 SW4.COM
N$50
  Bottom 0.254: LN4.A 123.71,2.16 124.78,3.23 126.84,3.23 128.16,1.91 130.53,1.91 133.45,4.83 R47.2 133.45,6.18 133.62,6.35 133.62,7.88 133.11,8.39 IC9.9
N$51
  Bottom 0.254: R46.2 136.67,10.5 R38.1 136.65,11.33 132.75,11.33 132.37,10.95 | 132.37,10.95 131.84,10.41 IC9.10 | 129.3,10.62 IC9.12 129.3,11.34 130.22,12.25 131.07,12.25 132.37,10.95
N$52  (via drill 0.35)
  Top 0.254: v122.95,13.46 122.95,11.18 120.66,8.89 90.15,8.89 89.4,8.13 79,8.13 78.25,8.89 73.9,8.89 72.91,7.91 72.91,6.35 v71.64,5.08
  Bottom 0.254: v122.95,13.46 122.95,13.72 127.02,17.78 U$7.P$1 | R35.1 71.48,4.91 v71.64,5.08
N$53
  Top 0.254: U$7.P$2 135.02,17.21 135.02,13.85 133.56,12.38 132.58,12.38 130.62,14.35 92.54,14.35 91.14,15.75 88.36,15.75 86.84,14.22 80.28,14.22 78.44,16.07 77.16,16.07 75.73,17.5 70.1,17.5 69.62,17.02 64.08,17.02 61.66,19.43 58.22,19.43 57.07,20.57 JP9.2
N$54
  Bottom 0.254: JP9.3 60.56,20.57 R39.2
N$55  (via drill 0.35)
  Top 0.254: U$6.P$2 112.34,1.85 v112.79,1.39
  Bottom 0.254: v112.79,1.39 120.28,1.39 122.19,3.3 122.19,7.87 122.95,8.64 R41.2
N$56
  Bottom 0.254: LP1.A 75.45,7.24 77.81,9.59 IC1.14
N$57
  Bottom 0.254: LN2.K 100.47,2.16 101.87,3.56 IC3.8
N$58
  Bottom 0.254: LP3.K 111.05,7.24 R44.2 111.75,7.93 111.75,9.56 IC6.13
N$59
  Bottom 0.254: IC3.14 93.81,9.59 91.46,7.24 LP2.A
N$60
  Bottom 0.254: LP3.A 107.97,7.24 110.32,9.59 IC6.14
N$61
  Bottom 0.508: JP5.2 JP5.1 15.64,5.71 D4.C
N$62
  Bottom 0.508: JP5.9 JP5.10 D3.A
N$64
  Bottom 0.254: LP4.K 127.31,7.24 | 127.31,7.24 R48.2 | 127.31,7.24 128,7.93 128,9.56 IC9.13
N$65
  Bottom 0.254: LP4.A 123.71,7.24 125.81,9.34 126.51,9.34 IC9.14
N$67
  Bottom 0.254: IC9.8 134.38,3.05 132.68,1.35 126.81,1.35 LN4.K
V+  (via drill 0.35)
  Bottom 0.254: C11.1 125.12,10.59 125.43,10.59 126.21,11.37 128.2,11.37 130.57,13.74 IC9.4 130.65,14.71 130.65,13.68 131.28,13.06 131.45,13.06 132.38,12.13 134.74,12.13 v135.23,12.62 | C10.1 108.71,11.33 111.93,11.33 114.32,13.71 IC6.4 | C9.1 92.72,10.45 93.63,11.37 96.02,11.37 v96.18,11.53 96.18,11.78 98.06,13.66 IC3.4 | C8.1 76.4,10.01 77.06,10.67 77.06,10.96 77.79,11.68 79.13,11.68 79.74,12.29 80.4,12.29 81.8,13.7 IC1.4
  Bottom 0.508: D3.C 23,14.61 C6.1 25.29,14.61 v25.42,14.73 | v74.76,15.43 74.74,15.41 R8.2 73.68,15.15 71.9,13.37 71.9,11.94 73.83,10.01 C8.1 | C10.1 108.03,10.64 v107.52,10.64
  Bottom 0.635: C16.+ v34.05,15.24
  pour Route15: 0.52,4.57 0.52,22.1 45.74,22.1 52.09,15.75 77.49,15.75 79.01,17.27 79.01,22.1 139.72,22.1 139.72,11.18 133.11,11.18 131.84,12.45 115.84,12.45 115.59,12.7 113.55,12.7 111.01,10.16 106.95,10.16 104.16,12.95 98.06,12.95 96.28,11.18 94.76,11.18 93.49,12.45 68.34,12.45 65.04,9.14 65.04,6.1 63.52,4.57 47.26,4.57 40.4,11.43 33.8,11.43 26.94,4.57
V-  (via drill 0.35)
  Bottom 0.254: C14.2 114.32,7.28 IC6.11 v114.32,11.24 | IC3.11 98.06,10.72 98.61,11.27 v98.61,11.52 | v86.57,3.24 86.19,3.24 84.6,4.83 84.6,6.6 84.09,7.11 83.42,7.11 C12.2
  Bottom 0.508: 81.76,9.55 IC1.11 81.8,8.14 82.88,7.07 83.19,7.07 C12.2 | C7.2 19.89,4.76 D4.A 21.1,2.54 v20.59,2.03 | C15.2 130.57,7.28 IC9.11 130.64,9.65 v130.64,11.24 | C13.2 98.06,7.02 IC3.11
  Bottom 0.635: C17.- v39.13,10.16
  pour Route15: 0.52,3.81 0.52,0.25 139.72,0.25 139.72,10.41 132.6,10.41 131.33,11.68 115.33,11.68 115.08,11.94 114.06,11.94 111.52,9.4 106.44,9.4 103.65,12.19 98.82,12.19 97.04,10.41 94.25,10.41 92.98,11.68 68.85,11.68 66.06,8.89 66.06,5.84 64.02,3.81 46.5,3.81 39.64,10.67 34.31,10.67 27.45,3.81

### Text on the board
bPlace: backup / caps | CH4 | CH3 | CH2 | 1U 4-channel / attenuverter / version 1 / schematics based / on mutable / shades | CH1 | jack input / normalization | -12V | 10V | 5V